# Altium schematic sheet [05] MICROCONTROLLER.SchDoc: Template
size A4; Author: Hom; CompanyName: KitSprout; DrawnBy: Hom; Engineer: Hom; Organization: KitSprout; Revision: A; SheetNumber: 5; SheetTotal: 6; Version: 0.0; LibVersion: 0.0
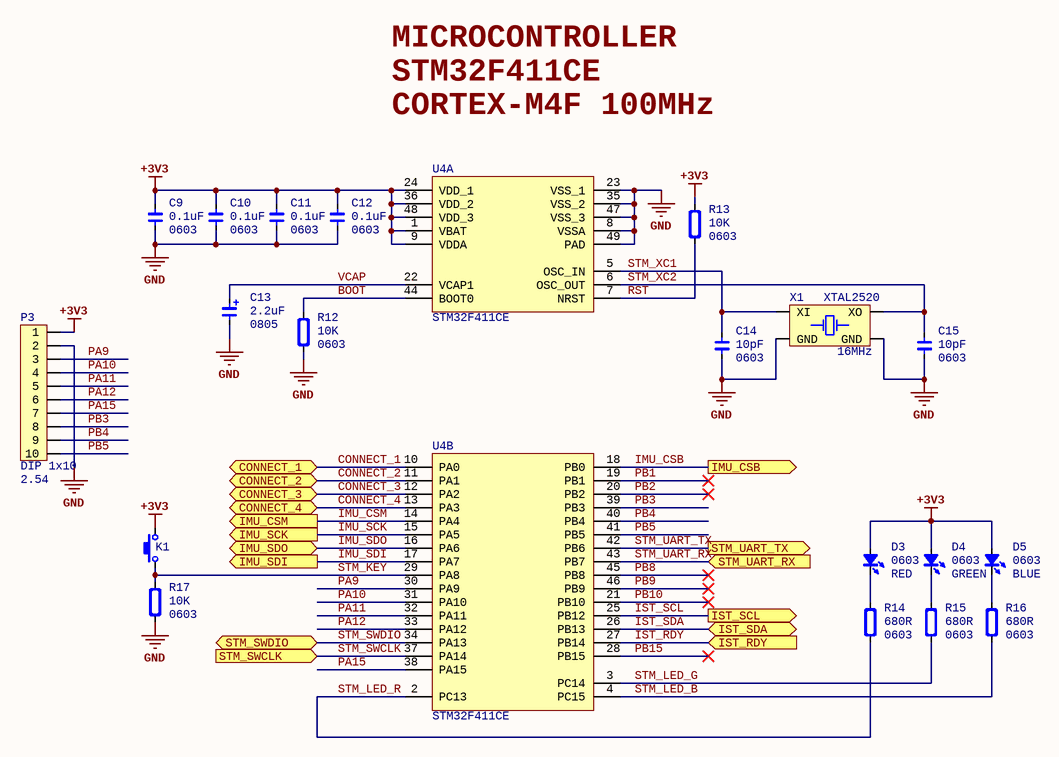
[diagram p0: [05] MICROCONTROLLER.SchDoc]

## Parts
C9  Type: 0603  [CAP_0603]  (hidden comment: 0.1uF)
C10  Type: 0603  [CAP_0603]  (hidden comment: 0.1uF)
C11  Type: 0603  [CAP_0603]  (hidden comment: 0.1uF)
C12  Type: 0603  [CAP_0603]  (hidden comment: 0.1uF)
C13  Type: 0805  [CAP_TAN_P0805]  (hidden comment: 2.2uF)
C14  Type: 0603  [CAP_0603]  (hidden comment: 10pF)
C15  Type: 0603  [CAP_0603]  (hidden comment: 10pF)
D3  Type: 0603  [LED_0603_RED]  (hidden comment: RED)
D4  Type: 0603  [LED_0603_GREEN]  (hidden comment: GREEN)
D5  Type: 0603  [LED_0603_BLUE]  (hidden comment: BLUE)
K1  ButtonTACT  [ButtonTACT_3x4x2_180H]  (value not drawn)
P3  value 2.54  [HDR1X10_2.54_180]  (hidden comment: DIP 1x10)
R12  Type: 0603  [RES_0603]  (hidden comment: 10K)
R13  Type: 0603  [RES_0603]  (hidden comment: 10K)
R14  Type: 0603  [RES_0603]  (hidden comment: 680R)
R15  Type: 0603  [RES_0603]  (hidden comment: 680R)
R16  Type: 0603  [RES_0603]  (hidden comment: 680R)
R17  Type: 0603  [RES_0603]  (hidden comment: 10K)
U4  STM32F411CE  [QFN_P0.5_48]  (parts A,B of 2)
X1  Type: XTAL2520  [XT_2520_4]  (hidden comment: 16MHz)

## Ports
CONNECT_1, CONNECT_2, CONNECT_3, CONNECT_4, IMU_CSB (out), IMU_CSM (out), IMU_SCK (out), IMU_SDI (out), IMU_SDO, IST_RDY (in), IST_SCL (out), IST_SDA (bidir), STM_SWCLK (in), STM_SWDIO (bidir), STM_UART_RX (in), STM_UART_TX (out)

## Nets
+3V3: C9.2 C10.2 C11.2 C12.2 D3.1(A) D4.1(A) D5.1(A) K1.2 P3.1 R13.2 U4.1(VBAT) U4.9(VDDA) U4.24(VDD_1) U4.36(VDD_2) U4.48(VDD_3)
GND: C9.1 C10.1 C11.1 C12.1 C13.2 C14.1 C15.1 P3.2 R12.1 R17.1 U4.8(VSSA) U4.23(VSS_1) U4.35(VSS_2) U4.47(VSS_3) U4.49(PAD) X1.2(GND) X1.4(GND)
BOOT: R12.2 U4.44(BOOT0)
CONNECT_1: U4.10(PA0) ; port CONNECT_1
CONNECT_2: U4.11(PA1) ; port CONNECT_2
CONNECT_3: U4.12(PA2) ; port CONNECT_3
CONNECT_4: U4.13(PA3) ; port CONNECT_4
IMU_CSB: U4.18(PB0) ; port IMU_CSB
IMU_CSM: U4.14(PA4) ; port IMU_CSM
IMU_SCK: U4.15(PA5) ; port IMU_SCK
IMU_SDI: U4.17(PA7) ; port IMU_SDI
IMU_SDO: U4.16(PA6) ; port IMU_SDO
IST_RDY: U4.27(PB14) ; port IST_RDY
IST_SCL: U4.25(PB12) ; port IST_SCL
IST_SDA: U4.26(PB13) ; port IST_SDA
PA9: P3.3 U4.30(PA9)
PA10: P3.4 U4.31(PA10)
PA11: P3.5 U4.32(PA11)
PA12: P3.6 U4.33(PA12)
PA15: P3.7 U4.38(PA15)
PB1: U4.19(PB1)
PB2: U4.20(PB2)
PB3: P3.8 U4.39(PB3)
PB4: P3.9 U4.40(PB4)
PB5: P3.10 U4.41(PB5)
PB8: U4.45(PB8)
PB9: U4.46(PB9)
PB10: U4.21(PB10)
PB15: U4.28(PB15)
RST: R13.1 U4.7(NRST)
STM_KEY: K1.1 R17.2 U4.29(PA8)
STM_LED_B: R16.1 U4.4(PC15)
STM_LED_G: R15.1 U4.3(PC14)
STM_LED_R: R14.1 U4.2(PC13)
STM_SWCLK: U4.37(PA14) ; port STM_SWCLK
STM_SWDIO: U4.34(PA13) ; port STM_SWDIO
STM_UART_RX: U4.43(PB7) ; port STM_UART_RX
STM_UART_TX: U4.42(PB6) ; port STM_UART_TX
STM_XC1: C14.2 U4.5(OSC_IN) X1.1(XI)
STM_XC2: C15.2 U4.6(OSC_OUT) X1.3(XO)
VCAP: C13.1 U4.22(VCAP1)
NetD3_2: D3.2(K) R14.2
NetD4_2: D4.2(K) R15.2
NetD5_2: D5.2(K) R16.2

## Notes on the sheet
- MICROCONTROLLER
- STM32F411CE
- CORTEX-M4F 100MHz

## Library data of the parts
C9-C12 C14 C15 = Cap_0603: Capacitor
  C9-C12: Value: 0.1uF
  C14 C15: Value: 10pF
C13 = Cap_Tan_0805: Capacitor Tantalum; Value: 2.2uF
D3-D5 = LED_0603: LED
  D3: Value: RED
  D4: Value: GREEN
  D5: Value: BLUE
K1 = ButtonTACT_3x4x2_180: Button; Value: ButtonTACT
P3 = HDR1x10_2.54T: Header; Type: DIP 1x10
R12-R17 = Res_0603: Resistor
  R12 R13 R17: Value: 10K
  R14-R16: Value: 680R
U4 = STM32F4x1C: MCU; Type: QFN48 P0.5
X1 = XTAL_2520_4P: Crystal Oscillator; Value: 16MHz